# Altium schematic sheet Analog_1_16.SchDoc
size A4; SheetNumber: 4; SheetTotal: 4
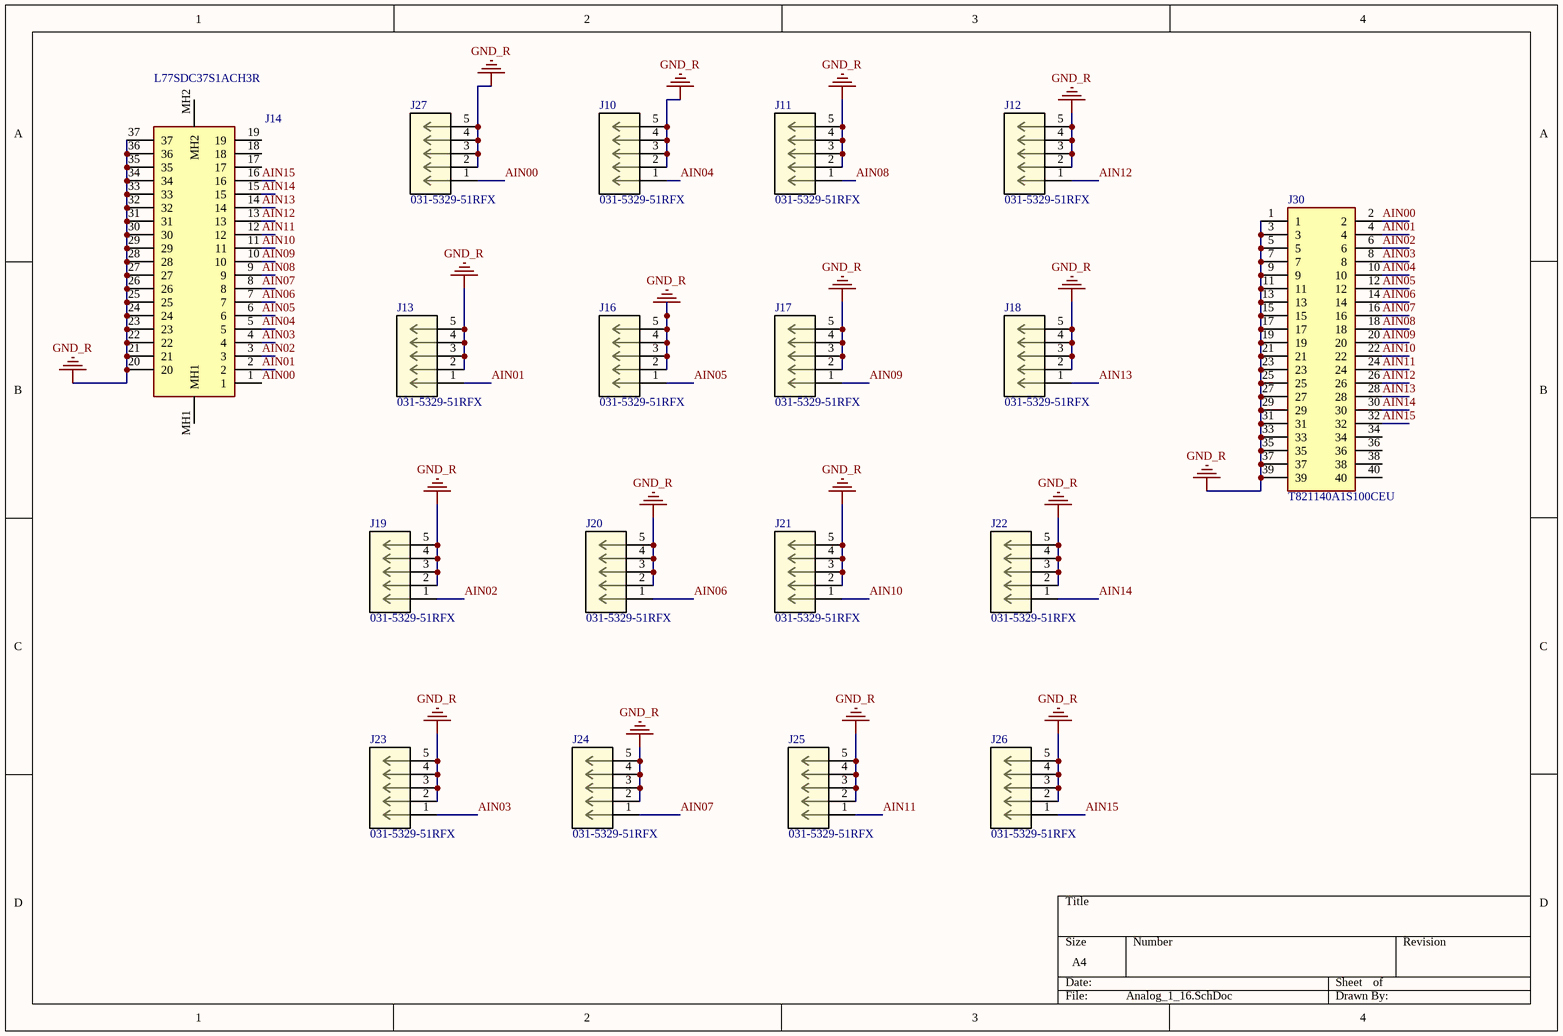
[diagram p0: Analog_1_16.SchDoc]

## Parts
J10  031-5329-51RFX  [CONN1_031-5329-51RFX_AMP]
J11  031-5329-51RFX  [CONN1_031-5329-51RFX_AMP]
J12  031-5329-51RFX  [CONN1_031-5329-51RFX_AMP]
J13  031-5329-51RFX  [CONN1_031-5329-51RFX_AMP]
J14  L77SDC37S1ACH3R  [L77SDC37S1ACH3R]
J16  031-5329-51RFX  [CONN1_031-5329-51RFX_AMP]
J17  031-5329-51RFX  [CONN1_031-5329-51RFX_AMP]
J18  031-5329-51RFX  [CONN1_031-5329-51RFX_AMP]
J19  031-5329-51RFX  [CONN1_031-5329-51RFX_AMP]
J20  031-5329-51RFX  [CONN1_031-5329-51RFX_AMP]
J21  031-5329-51RFX  [CONN1_031-5329-51RFX_AMP]
J22  031-5329-51RFX  [CONN1_031-5329-51RFX_AMP]
J23  031-5329-51RFX  [CONN1_031-5329-51RFX_AMP]
J24  031-5329-51RFX  [CONN1_031-5329-51RFX_AMP]
J25  031-5329-51RFX  [CONN1_031-5329-51RFX_AMP]
J26  031-5329-51RFX  [CONN1_031-5329-51RFX_AMP]
J27  031-5329-51RFX  [CONN1_031-5329-51RFX_AMP]
J30  T821140A1S100CEU  [SHDR40W64P254X254_2X20_5842X895X915P]

## Nets
GND_R: J10.2 J10.3 J10.4 J10.5 J11.2 J11.3 J11.4 J11.5 J12.2 J12.3 J12.4 J12.5 J13.2 J13.3 J13.4 J13.5 J14.20 J14.21 J14.22 J14.23 J14.24 J14.25 J14.26 J14.27 J14.28 J14.29 J14.30 J14.31 J14.32 J14.33 J14.34 J14.35 J14.36 J14.37 J16.2 J16.3 J16.4 J16.5 J17.2 J17.3 J17.4 J17.5 J18.2 J18.3 J18.4 J18.5 J19.2 J19.3 J19.4 J19.5 J20.2 J20.3 J20.4 J20.5 J21.2 J21.3 J21.4 J21.5 J22.2 J22.3 J22.4 J22.5 J23.2 J23.3 J23.4 J23.5 J24.2 J24.3 J24.4 J24.5 J25.2 J25.3 J25.4 J25.5 J26.2 J26.3 J26.4 J26.5 J27.2 J27.3 J27.4 J27.5 J30.1 J30.3 J30.5 J30.7 J30.9 J30.11 J30.13 J30.15 J30.17 J30.19 J30.21 J30.23 J30.25 J30.27 J30.29 J30.31 J30.33 J30.35 J30.37 J30.39
AIN00: J14.1 J27.1 J30.2
AIN01: J13.1 J14.2 J30.4
AIN02: J14.3 J19.1 J30.6
AIN03: J14.4 J23.1 J30.8
AIN04: J10.1 J14.5 J30.10
AIN05: J14.6 J16.1 J30.12
AIN06: J14.7 J20.1 J30.14
AIN07: J14.8 J24.1 J30.16
AIN08: J11.1 J14.9 J30.18
AIN09: J14.10 J17.1 J30.20
AIN10: J14.11 J21.1 J30.22
AIN11: J14.12 J25.1 J30.24
AIN12: J12.1 J14.13 J30.26
AIN13: J14.14 J18.1 J30.28
AIN14: J14.15 J22.1 J30.30
AIN15: J14.16 J26.1 J30.32

Not connected (* = marked no-connect by the designer): J14 17 18 19 MH1 MH2; J30 34 36 38 40

## Library data of the parts
J10-J13 J16-J27 = 031-5329-51RFX: No Description Available; Mfr_Name: Amphenol ICC; RefDes: RefDes; Type: Type
J14 = L77SDC37S1ACH3R: Connector; Manufacturer_Name: Amphenol; Datasheet Link: https://cdn.amphenol-cs.com/media/wysiwyg/files/drawing/l77sdxxxs1ach3r.pdf; Height: 12.93mm; Manufacturer_Part_Number: L77SDC37S1ACH3R; Mouser Part Number: 523-L77SDC37S1ACH3R; Mouser Price/Stock: https://www.mouser.co.uk/ProductDetail/Amphenol-Commercial-Products/L77SDC37S1ACH3R?qs=mq7kV%2Fq8lk7HpO2gUh7qRA%3D%3D
J30 = T821140A1S100CEU: Connector; Manufacturer_Name: Amphenol; Datasheet Link: http://www.farnell.com/datasheets/1648843.pdf; Height: 9.15mm; Manufacturer_Part_Number: T821140A1S100CEU; Mouser Part Number: N/A; Mouser Price/Stock: https://www.mouser.co.uk/ProductDetail/Amphenol/T821140A1S100CEU?qs=%252BRAvXJslkuDIVA7vEt1SFA%3D%3D; Arrow Part Number: T821140A1S100CEU; Arrow Price/Stock: https://www.arrow.com/en/products/t821140a1s100ceu/amphenol-fci?region=europe